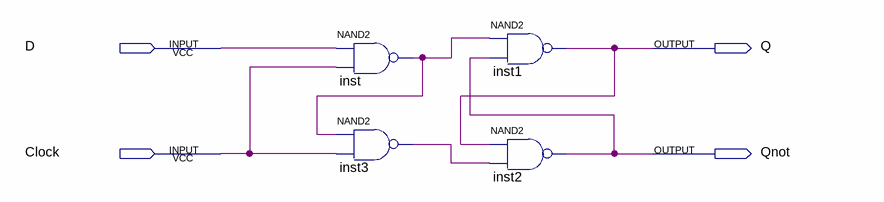
[diagram p0: schematic sheet]
// Quartus schematic Lab9DD_FF.bdf as structural Verilog: 4 symbols, 4 pins
module Lab9DD_FF (
  input  D,
  input  Clock,
  output Q,
  output Qnot
);

  wire inst3_out, inst_out;

  nand inst (inst_out, D, Clock);
  nand inst3 (inst3_out, inst_out, Clock);
  nand inst1 (Q, inst_out, Qnot);
  nand inst2 (Qnot, Q, inst3_out);
endmodule
